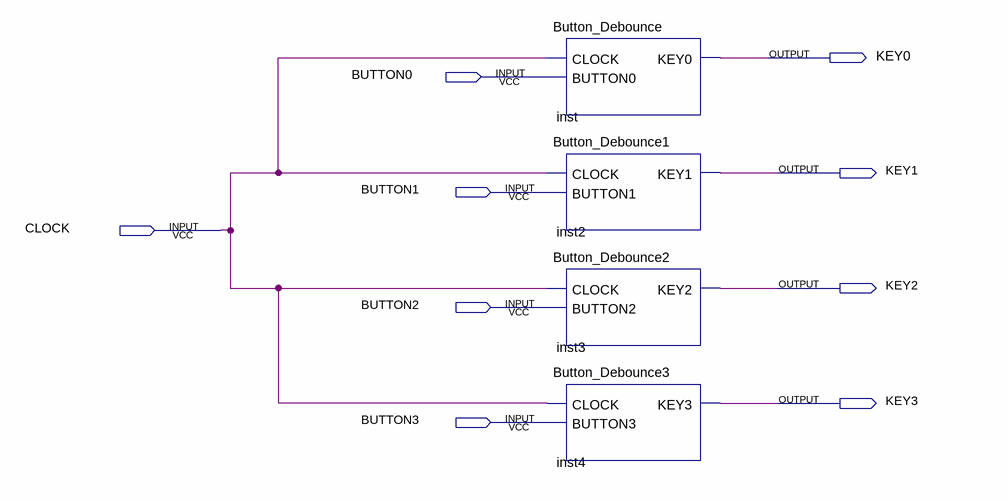
[diagram p0: schematic sheet]
// Quartus schematic Button_DebounceA.bdf as structural Verilog: 4 symbols, 9 pins
module Button_DebounceA (
  input  BUTTON0,
  input  BUTTON1,
  input  CLOCK,
  input  BUTTON2,
  input  BUTTON3,
  output KEY0,
  output KEY1,
  output KEY2,
  output KEY3
);

  Button_Debounce inst (.CLOCK(CLOCK), .BUTTON0(BUTTON0), .KEY0(KEY0));
  Button_Debounce1 inst2 (.CLOCK(CLOCK), .KEY1(KEY1));  // open: BUTTON1
  Button_Debounce2 inst3 (.CLOCK(CLOCK), .KEY2(KEY2));  // open: BUTTON2
  Button_Debounce3 inst4 (.CLOCK(CLOCK), .KEY3(KEY3));  // open: BUTTON3
endmodule
